# Altium project Var_7_prj.PrjPCB
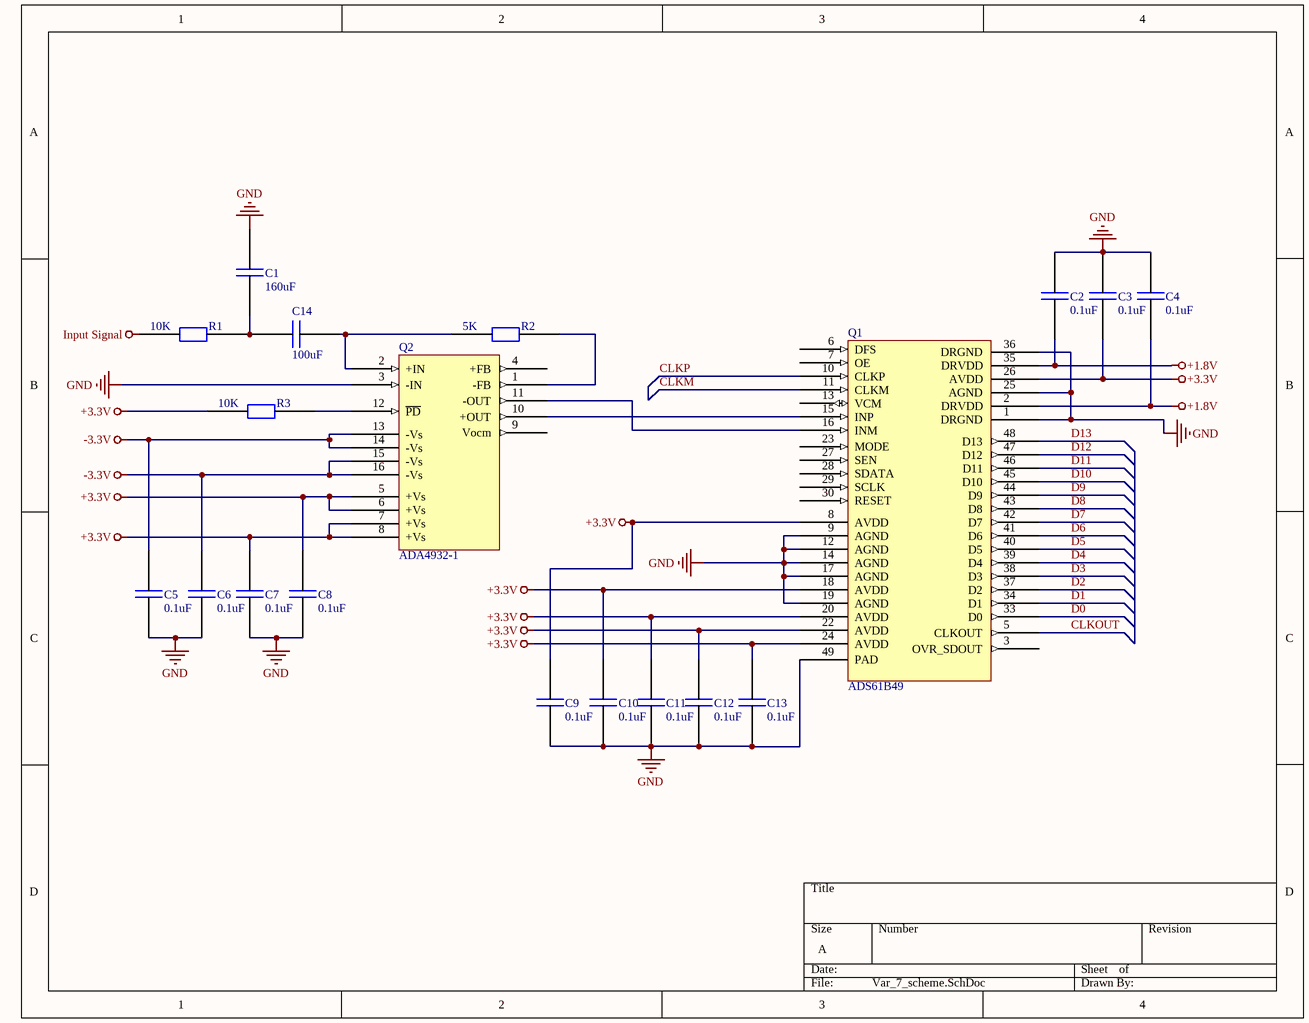
[diagram p0: Var_7_scheme.SchDoc]
1 sheet, 19 parts. Net scope: global (net labels, ports and power ports of the same name join across sheets).
Board file: Var_7_PCB.PcbDoc

## Sheet Var_7_scheme.SchDoc
size A

### Parts
C1  160uF  [CAP0603]
C2  0.1uF  [CAP0603]
C3  0.1uF  [CAP0603]
C4  0.1uF  [CAP0603]
C5  0.1uF  [CAP0603]
C6  0.1uF  [CAP0603]
C7  0.1uF  [CAP0603]
C8  0.1uF  [CAP0603]
C9  0.1uF  [CAP0603]
C10  0.1uF  [CAP0603]
C11  0.1uF  [CAP0603]
C12  0.1uF  [CAP0603]
C13  0.1uF  [CAP0603]
C14  100uF  [CAP0603]
Q1  ADS61B49  [QFN49]
Q2  ADA4932-1  [QFN17]
R1  10K  [RES0805]
R2  5K  [RES0805]
R3  10K  [RES0805]

### Nets
+1.8V: C2.2 C4.2 Q1.2(DRVDD) Q1.35(DRVDD)
+3.3V: C3.2 C7.1 C8.1 C9.1 C10.1 C11.1 C12.1 C13.1 Q1.8(AVDD) Q1.18(AVDD) Q1.20(AVDD) Q1.22(AVDD) Q1.24(AVDD) Q1.26(AVDD) Q2.5(+Vs) Q2.6(+Vs) Q2.7(+Vs) Q2.8(+Vs) R3.2
-3.3V: C5.1 C6.1 Q2.13(-Vs) Q2.14(-Vs) Q2.15(-Vs) Q2.16(-Vs)
GND: C1.2 C2.1 C3.1 C4.1 C5.2 C6.2 C7.2 C8.2 C9.2 C10.2 C11.2 C12.2 C13.2 Q1.1(DRGND) Q1.9(AGND) Q1.12(AGND) Q1.14(AGND) Q1.17(AGND) Q1.19(AGND) Q1.25(AGND) Q1.36(DRGND) Q1.49(PAD) Q2.3(-IN)
Input Signal: R1.2
CLKM: Q1.11(CLKM)
CLKOUT: Q1.5(CLKOUT)
CLKP: Q1.10(CLKP)
D0: Q1.33(D0)
D1: Q1.34(D1)
D2: Q1.37(D2)
D3: Q1.38(D3)
D4: Q1.39(D4)
D5: Q1.40(D5)
D6: Q1.41(D6)
D7: Q1.42(D7)
D8: Q1.43(D8)
D9: Q1.44(D9)
D10: Q1.45(D10)
D11: Q1.46(D11)
D12: Q1.47(D12)
D13: Q1.48(D13)
NetC1_1: C1.1 C14.1 R1.1
NetC14_2: C14.2 Q2.2(+IN) R2.2
NetQ1_15: Q1.15(INP) Q2.10(+OUT)
NetQ1_16: Q1.16(INM) Q2.11(-OUT)
NetQ2_1: Q2.1(-FB) R2.1
NetQ2_12: Q2.12(~{PD}) R3.1

Not connected (* = marked no-connect by the designer): Q1 3(OVR_SDOUT) 4(UNUSED) 6(DFS) 7(OE) 13(VCM) 21(NC) 23(MODE) 27(SEN) 28(SDATA) 29(SCLK) 30(RESET) 31(NC) 32(NC); Q2 4(+FB) 9(Vocm) 17(PAD)

### Library data of the parts
C1-C14 = Capacitor
R1-R3 = Resistor